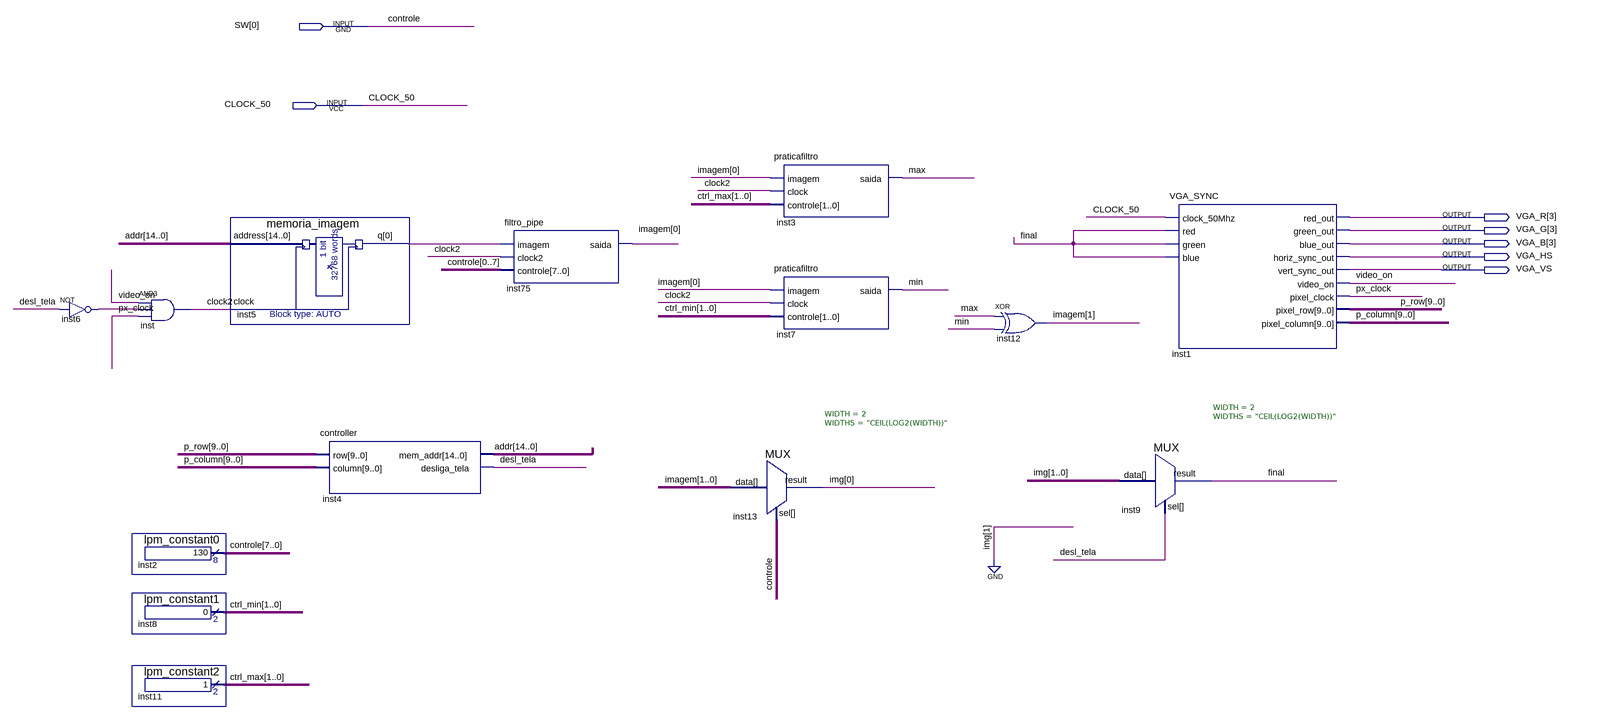
[diagram p0: schematic sheet]
// Quartus schematic top-level.bdf as structural Verilog: 14 symbols, 7 pins
module \top-level  (
  input  [0:0] SW,
  input  CLOCK_50,
  output [3:3] VGA_R,
  output [3:3] VGA_G,
  output [3:3] VGA_B,
  output VGA_HS,
  output VGA_VS
);

  wire clock2, desl_tela, \final , inst5_q, inst6_out, max, min, px_clock, video_on;
  wire [0:0] img;
  wire [1:0] ctrl_max, ctrl_min, imagem;
  wire [7:0] controle;
  wire [9:0] p_column, p_row;
  wire [14:0] addr;

  not inst6 (inst6_out, desl_tela);
  and inst (clock2, video_on, inst6_out, px_clock);
  lpm_constant0 inst2 (.result(controle));
  lpm_constant1 inst8 (.result(ctrl_min));
  lpm_constant2 inst11 (.result(ctrl_max));
  memoria_imagem inst5 (.address(addr), .clock(clock2), .q(inst5_q));
  controller inst4 (.row(p_row), .column(p_column), .mem_addr(addr), .desliga_tela(desl_tela));
  filtro_pipe inst75 (
    .imagem(inst5_q), .clock2(clock2),
    .controle({controle[0], controle[1], controle[2], controle[3], controle[4], controle[5], controle[6], controle[7]}),
    .saida(imagem[0]));
  praticafiltro inst3 (.imagem(imagem[0]), .clock(clock2), .controle(ctrl_max), .saida(max));
  praticafiltro inst7 (.imagem(imagem[0]), .clock(clock2), .controle(ctrl_min), .saida(min));
  MUX #(.WIDTH(2), .WIDTHS("CEIL(LOG2(WIDTH))")) inst13 (.data(imagem), .sel(SW[0]), .result(img[0]));
  xor inst12 (imagem[1], max, min);
  MUX #(.WIDTH(2), .WIDTHS("CEIL(LOG2(WIDTH))")) inst9 (.data({1'b0, img[0]}), .sel(desl_tela), .result(\final ));
  VGA_SYNC inst1 (
    .clock_50Mhz(CLOCK_50), .red(\final ), .green(\final ), .blue(\final ), .red_out(VGA_R[3]),
    .green_out(VGA_G[3]), .blue_out(VGA_B[3]), .horiz_sync_out(VGA_HS), .vert_sync_out(VGA_VS),
    .video_on(video_on), .pixel_clock(px_clock), .pixel_row(p_row), .pixel_column(p_column));

  // Other names for the same wires on the sheet: controle = SW[0]
endmodule
